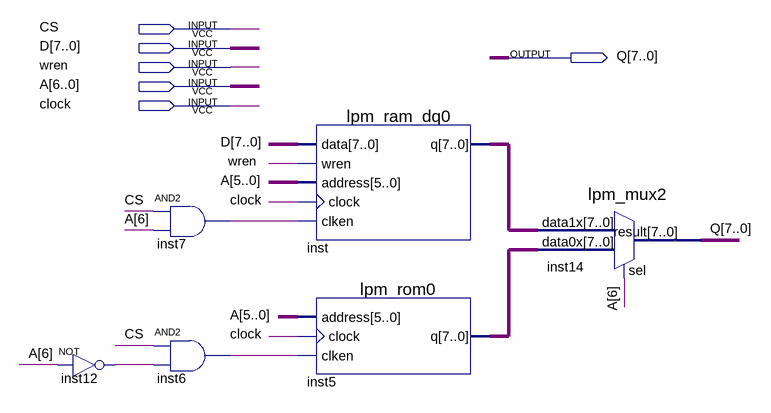
[diagram p0: schematic sheet]
// Quartus schematic MEM.bdf as structural Verilog: 6 symbols, 6 pins
module MEM (
  input  CS,
  input  [7:0] D,
  input  wren,
  input  [6:0] A,
  input  clock,
  output [7:0] Q
);

  wire inst6_out, inst7_out, inst12_out;
  wire [7:0] inst5_q, inst_q;

  not inst12 (inst12_out, A[6]);
  and inst7 (inst7_out, CS, A[6]);
  and inst6 (inst6_out, CS, inst12_out);
  lpm_ram_dq0 inst (.data(D), .wren(wren), .address(A[5:0]), .clock(clock), .clken(inst7_out), .q(inst_q));
  lpm_rom0 inst5 (.address(A[5:0]), .clock(clock), .clken(inst6_out), .q(inst5_q));
  lpm_mux2 inst14 (.data1x(inst_q), .data0x(inst5_q), .sel(A[6]), .result(Q));
endmodule
